# EAGLE design easiri (EAGLE 9.6.2)
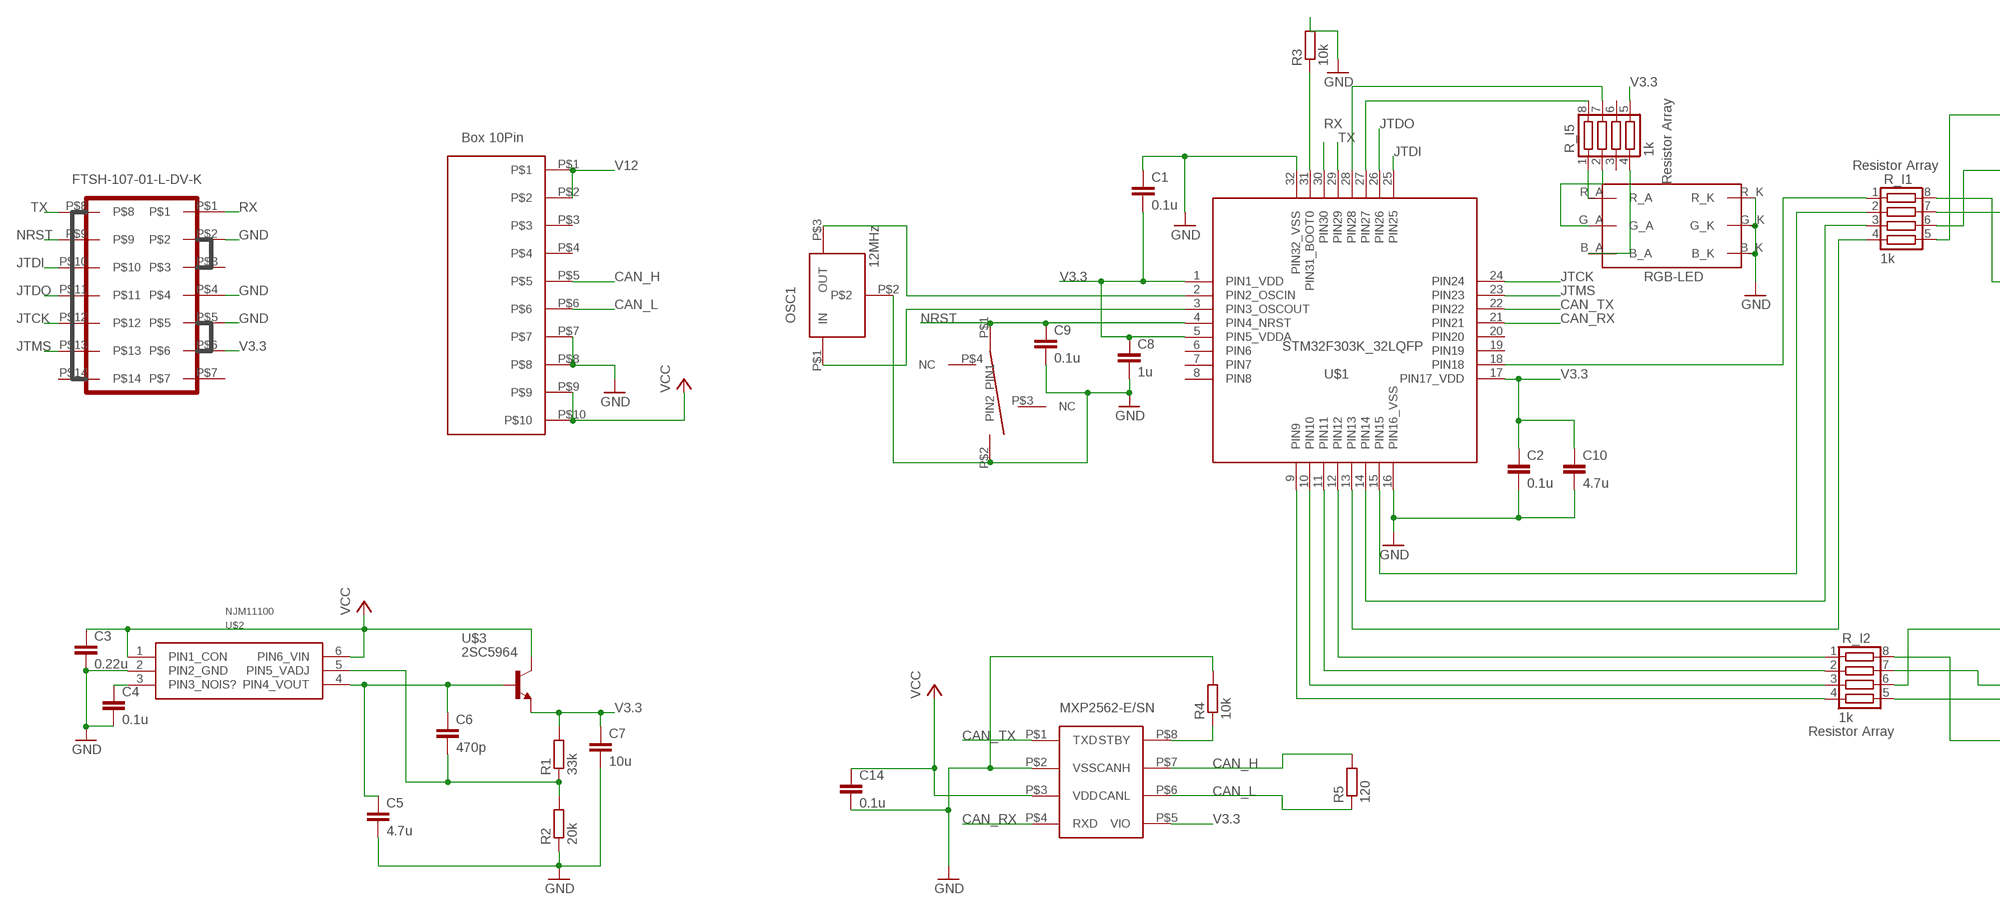
[diagram p0: schematic, sheet 1, part 1 of 2]
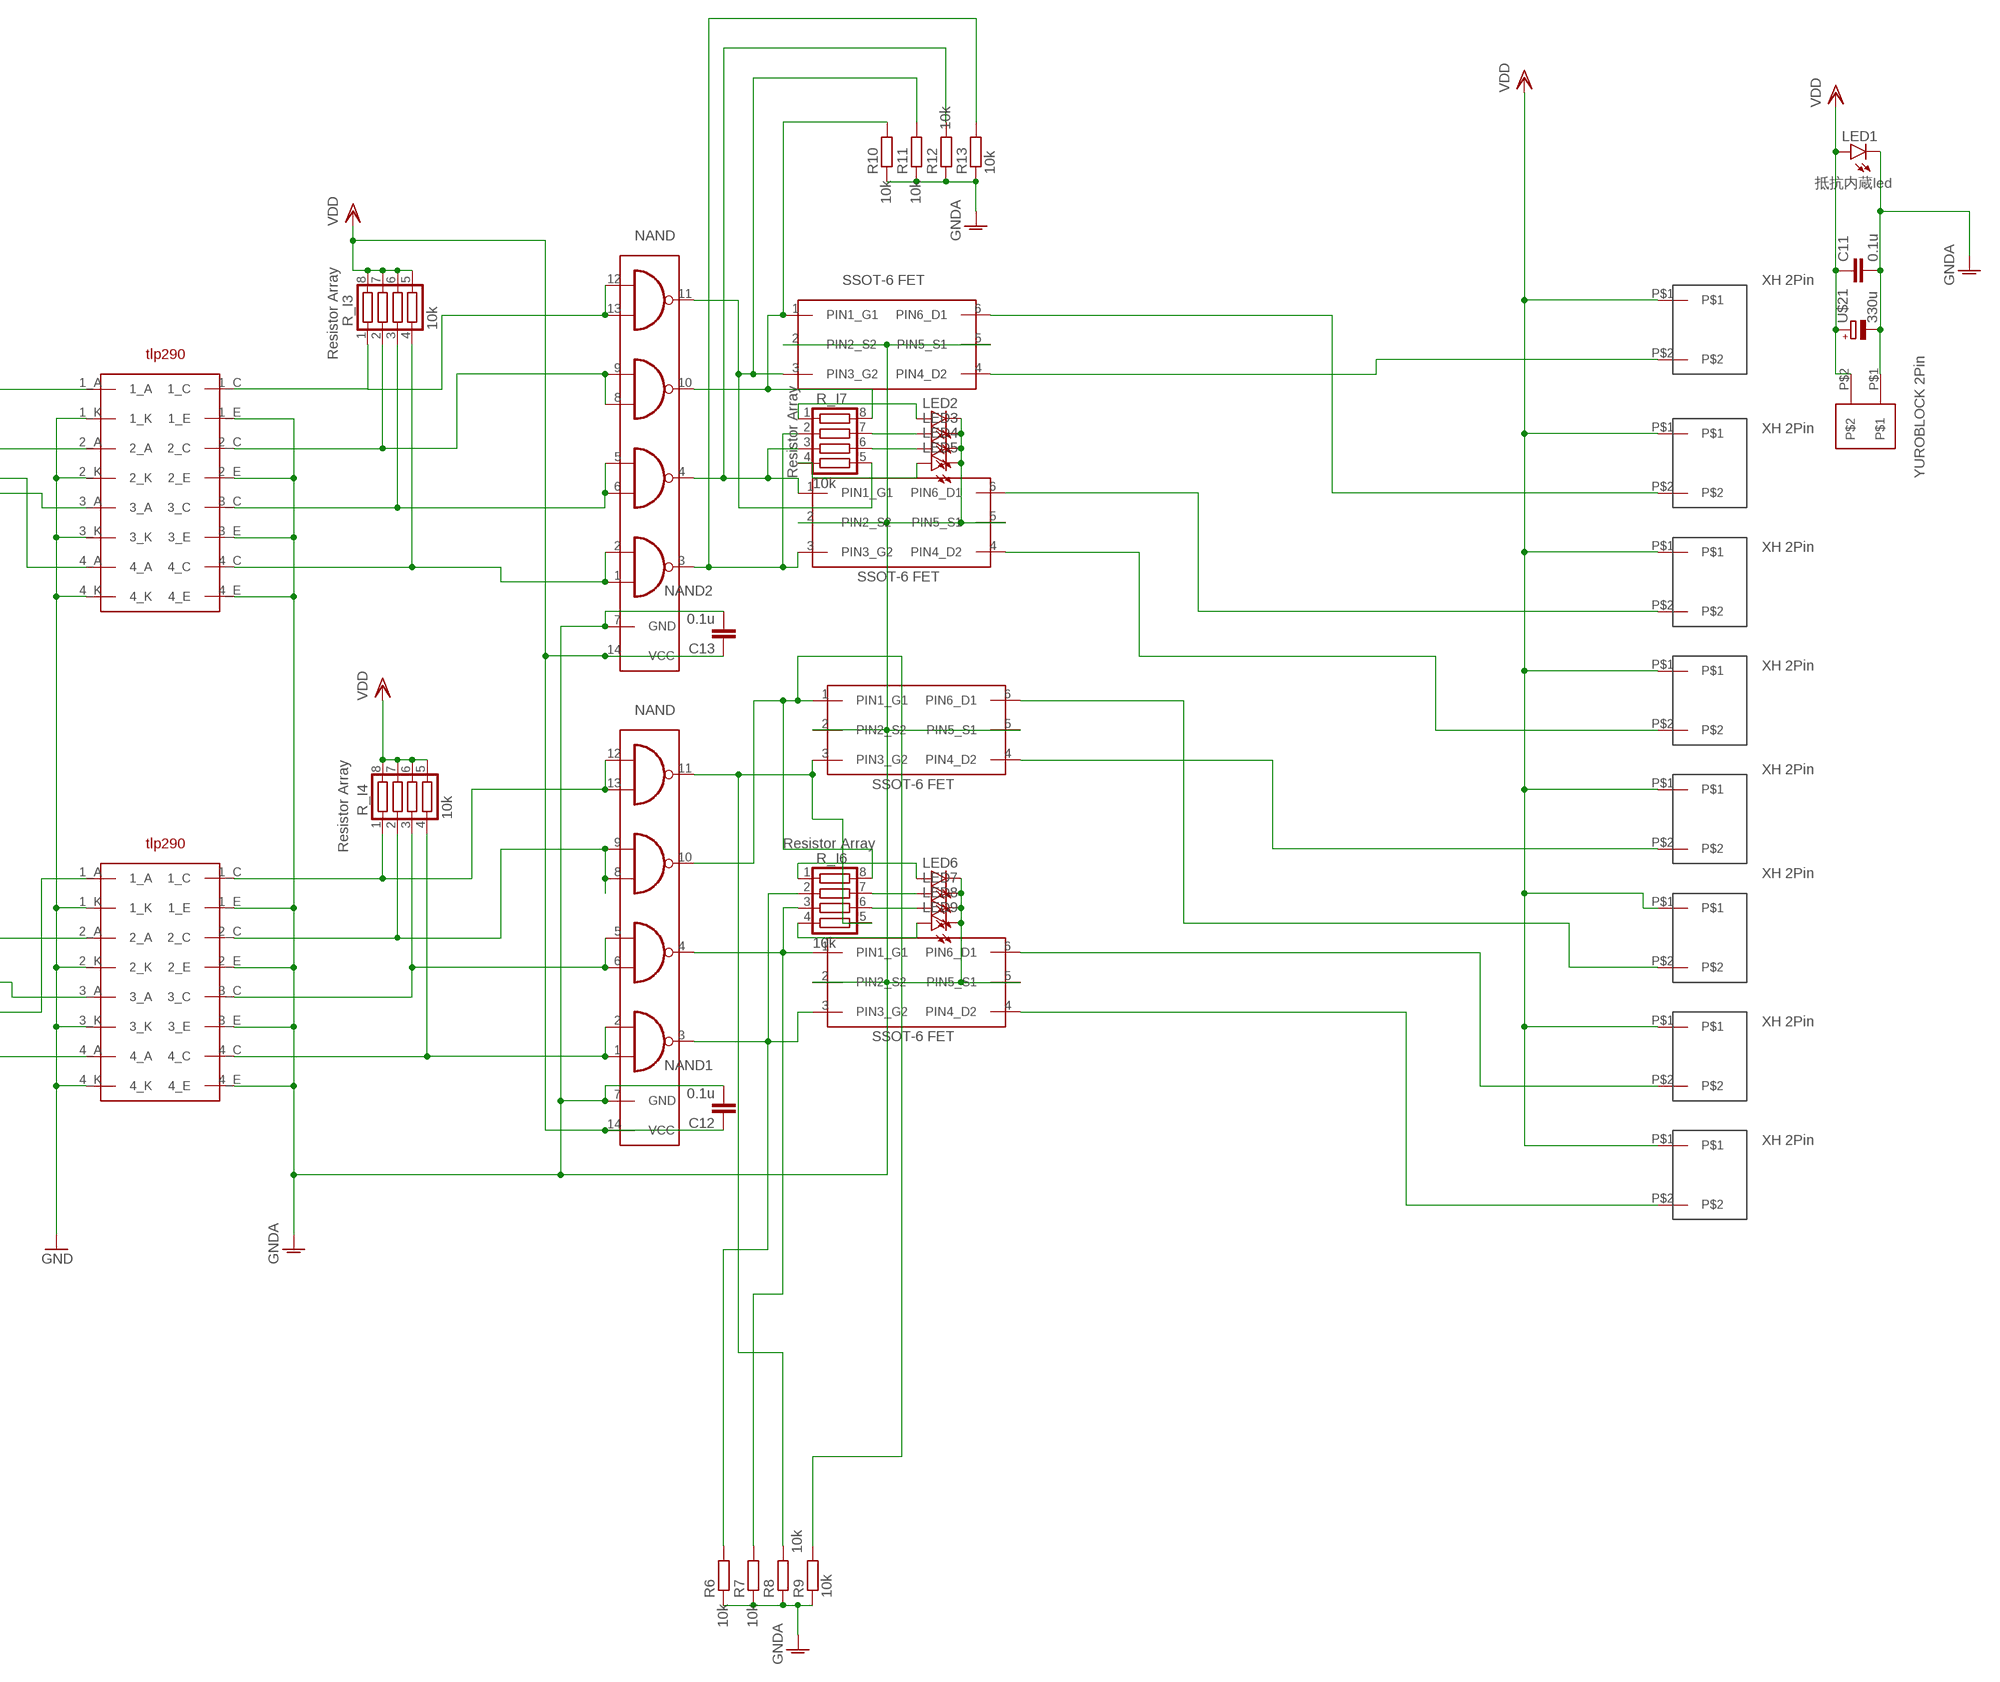
[diagram p1: schematic, sheet 1, part 2 of 2]

## Parts
BOX10P-L2  BOX10PBOX10P-L  [BOX10P-L]
C1  0.1u  C-EUC1608  [C1608]
C2  0.1u  C-EUC1608  [C1608]
C3  0.22u  C-EUC2012  [C2012]
C4  0.1u  C-EUC1608  [C1608]
C5  4.7u  C-EUC2012  [C2012]
C6  470p  C-EUC1608  [C1608]
C7  10u  C-EUC2012  [C2012]
C8  1u  C-EUC1608  [C1608]
C9  0.1u  C-EUC1608  [C1608]
C10  4.7u  C-EUC2012  [C2012]
C11  0.1u  C-EUC1608  [C1608]
C12  0.1u  C-EUC1608  [C1608]
C13  0.1u  C-EUC1608  [C1608]
C14  0.1u  C-EUC1608  [C1608]
ES1  XH_2P  [XH_2P]
ES2  XH_2P  [XH_2P]
ES3  XH_2P  [XH_2P]
ES4  XH_2P  [XH_2P]
ES5  XH_2P  [XH_2P]
ES6  XH_2P  [XH_2P]
ES7  XH_2P  [XH_2P]
ES8  XH_2P  [XH_2P]
LED1  抵抗内蔵led  LED5MM  [LED5MM]
LED2  1608LED  [1608]
LED3  1608LED  [1608]
LED4  1608LED  [1608]
LED5  1608LED  [1608]
LED6  1608LED  [1608]
LED7  1608LED  [1608]
LED8  1608LED  [1608]
LED9  1608LED  [1608]
NAND1  14PIN_NAND2  [TSSOP14]
NAND2  14PIN_NAND2  [TSSOP14]
OSC1  12MHz  CSTN#  [CSTNE#]
R1  33k  R_REG  [1608]
R2  20k  R_REG  [1608]
R3  10k  R_REG  [1608]
R4  10k  R_REG  [1608]
R5  120  R_REG  [1608]
R6  10k  R_REG  [1608]
R7  10k  R_REG  [1608]
R8  10k  R_REG  [1608]
R9  10k  R_REG  [1608]
R10  10k  R_REG  [1608]
R11  10k  R_REG  [1608]
R12  10k  R_REG  [1608]
R13  10k  R_REG  [1608]
R_I1  1k  R_SHUGOU  [0603X4RESISTOR]
R_I2  1k  R_SHUGOU  [0603X4RESISTOR]
R_I3  10k  R_SHUGOU2  [1005X4RESISTOR]
R_I4  10k  R_SHUGOU2  [1005X4RESISTOR]
R_I5  1k  R_SHUGOU  [0603X4RESISTOR]
R_I6  10k  R_SHUGOU2  [1005X4RESISTOR]
R_I7  10k  R_SHUGOU2  [1005X4RESISTOR]
U$1  STM32F303K_32LQFP  [LQFP32-7X7]
U$2  NJM11100  [SOT23-6]
U$3  2SC5964  [PCP]
U$4  TAKUTOSUITTI2  [TAKUTOSUITTI2]
U$5  MCP2562MCP2561-SN  [SOIC8]
U$6  TLP290-4  [TLP290]
U$7  TLP290-4  [TLP290]
U$8  SSOT6_FET  [SSOT6]
U$9  SSOT6_FET  [SSOT6]
U$10  SSOT6_FET  [SSOT6]
U$11  SSOT6_FET  [SSOT6]
U$12  YUROBLOCK2  [YUROBLOCK2]
U$13  FTSH-107-01-L-DV-K  [FTSH-107-01-L-DV-K]
U$21  330u  C_DEKAI  [1014CAPA]
U$23  RGB_LED  [RGB_LED]

## Nets
CAN_H: BOX10P-L2.P$5 R5.2 U$5.P$7(CANH)
CAN_L: BOX10P-L2.P$6 R5.1 U$5.P$6(CANL)
CAN_RX: U$1.21(PIN21) U$5.P$4(RXD)
CAN_TX: U$1.22(PIN22) U$5.P$1(TXD)
GND: BOX10P-L2.P$7 BOX10P-L2.P$8 C1.1 C2.2 C3.2 C4.2 C5.2 C7.2 C8.2 C9.2 C10.2 C14.2 OSC1.P$2 R2.1 R3.2 R4.2 U$1.16(PIN16_VSS) U$1.32(PIN32_VSS) U$2.2(PIN2_GND) U$4.P$2(PIN2) U$5.P$2(VSS) U$6.1_K U$6.2_K U$6.3_K U$6.4_K U$7.1_K U$7.2_K U$7.3_K U$7.4_K U$13.P$2 U$13.P$4 U$13.P$5 U$23.B_K U$23.G_K U$23.R_K
GNDA: C11.2 C12.2 C13.2 LED1.K(C) LED2.K LED3.K LED4.K LED5.K LED6.K LED7.K LED8.K LED9.K NAND1.7(GND) NAND2.7(GND) R6.1 R7.1 R8.1 R9.1 R10.1 R11.1 R12.1 R13.1 U$6.1_E U$6.2_E U$6.3_E U$6.4_E U$7.1_E U$7.2_E U$7.3_E U$7.4_E U$8.2(PIN2_S2) U$8.5(PIN5_S1) U$9.2(PIN2_S2) U$9.5(PIN5_S1) U$10.2(PIN2_S2) U$10.5(PIN5_S1) U$11.2(PIN2_S2) U$11.5(PIN5_S1) U$12.P$1 U$21.-
JTCK: U$1.24(PIN24) U$13.P$12
JTDI: U$1.25(PIN25) U$13.P$10
JTDO: U$1.26(PIN26) U$13.P$11
JTMS: U$1.23(PIN23) U$13.P$13
N$1: C6.2 R1.1 R2.2 U$2.5(PIN5_VADJ)
N$2: C4.1 U$2.3(PIN3_NOIS?)
N$3: C5.1 C6.1 U$2.4(PIN4_VOUT) U$3.1(B)
N$4: OSC1.P$1(IN) U$1.3(PIN3_OSCOUT)
N$5: OSC1.P$3(OUT) U$1.2(PIN2_OSCIN)
N$6: R3.1 U$1.31(PIN31_BOOT0)
N$7: R_I1.8 U$6.4_A
N$8: R_I1.7 U$6.3_A
N$9: R4.1 U$5.P$8(STBY)
N$10: R_I1.6 U$6.2_A
N$11: R_I5.8 U$1.27(PIN27)
N$12: R_I2.6 U$7.2_A
N$13: NAND2.12(4B) NAND2.13(4A) R_I3.1 U$6.1_C
N$14: R_I2.7 U$7.3_A
N$15: R_I2.8 U$7.4_A
N$16: R_I2.5 U$7.1_A
N$17: NAND1.5(2B) NAND1.6(2A) R_I4.3 U$7.3_C
N$18: NAND2.5(2B) NAND2.6(2A) R_I3.3 U$6.3_C
N$19: NAND1.1(1A) NAND1.2(1B) R_I4.4 U$7.4_C
N$20: NAND1.3(1Y) R6.2 R_I6.2 U$11.3(PIN3_G2)
N$21: NAND1.8(3A) NAND1.9(3B) R_I4.2 U$7.2_C
N$22: LED8.A R_I6.6
N$23: LED7.A R_I6.7
N$24: ES3.P$2 U$9.6(PIN6_D1)
N$25: ES1.P$2 U$8.4(PIN4_D2)
N$26: ES2.P$2 U$8.6(PIN6_D1)
N$27: ES4.P$2 U$9.4(PIN4_D2)
N$28: LED4.A R_I7.6
N$29: ES6.P$2 U$10.6(PIN6_D1)
N$30: ES7.P$2 U$11.6(PIN6_D1)
N$31: R_I2.1 U$1.12(PIN12)
N$32: ES8.P$2 U$11.4(PIN4_D2)
N$33: R_I2.2 U$1.11(PIN11)
N$34: R_I2.3 U$1.10(PIN10)
N$35: R_I2.4 U$1.9(PIN9)
N$36: R_I1.4 U$1.13(PIN13)
N$37: R_I1.3 U$1.14(PIN14)
N$38: R_I1.5 U$6.1_A
N$39: R_I1.2 U$1.15(PIN15)
N$40: R_I5.7 U$1.28(PIN28)
N$41: R_I1.1 U$1.18(PIN18)
N$42: R_I5.4 U$23.B_A
N$43: R_I5.1 U$23.R_A
N$44: R_I5.2 U$23.G_A
N$45: NAND1.4(2Y) R7.2 R_I6.3 U$11.1(PIN1_G1)
N$46: ES5.P$2 U$10.4(PIN4_D2)
N$47: NAND2.8(3A) NAND2.9(3B) R_I3.2 U$6.2_C
N$48: NAND2.1(1A) NAND2.2(1B) R_I3.4 U$6.4_C
N$49: NAND1.12(4B) NAND1.13(4A) R_I4.1 U$7.1_C
N$50: NAND1.10(3Y) R9.2 R_I6.8 U$10.1(PIN1_G1)
N$51: NAND2.3(1Y) R13.2 R_I7.2 U$9.3(PIN3_G2)
N$52: NAND2.4(2Y) R12.2 R_I7.3 U$9.1(PIN1_G1)
N$53: NAND2.10(3Y) R10.2 R_I7.8 U$8.1(PIN1_G1)
N$54: NAND2.11(4Y) R11.2 R_I7.5 U$8.3(PIN3_G2)
N$55: LED9.A R_I6.4
N$56: LED6.A R_I6.1
N$57: NAND1.11(4Y) R8.2 R_I6.5 U$10.3(PIN3_G2)
N$58: LED3.A R_I7.7
N$59: LED5.A R_I7.4
N$60: LED2.A R_I7.1
NRST: C9.1 U$1.4(PIN4_NRST) U$4.P$1(PIN1) U$13.P$9
RX: U$1.30(PIN30) U$13.P$1
TX: U$1.29(PIN29) U$13.P$8
V3.3: C1.2 C2.1 C7.1 C8.1 C10.1 R1.2 R_I5.5 U$1.1(PIN1_VDD) U$1.5(PIN5_VDDA) U$1.17(PIN17_VDD) U$3.3(E) U$5.P$5(VIO) U$13.P$6
V12: BOX10P-L2.P$1 BOX10P-L2.P$2
VCC: BOX10P-L2.P$9 BOX10P-L2.P$10 C3.1 C14.1 U$2.1(PIN1_CON) U$2.6(PIN6_VIN) U$3.2(C) U$3.2@2(C) U$5.P$3(VDD)
VDD: C11.1 C12.1 C13.1 ES1.P$1 ES2.P$1 ES3.P$1 ES4.P$1 ES5.P$1 ES6.P$1 ES7.P$1 ES8.P$1 LED1.A NAND1.14(VCC) NAND2.14(VCC) R_I3.5 R_I3.6 R_I3.7 R_I3.8 R_I4.5 R_I4.6 R_I4.7 R_I4.8 U$12.P$2 U$21.+
Unconnected: BOX10P-L2.P$3 BOX10P-L2.P$4 R_I5.3 R_I5.6 U$1.6(PIN6) U$1.7(PIN7) U$1.8(PIN8) U$1.19(PIN19) U$1.20(PIN20) U$4.P$3(NC) U$4.P$4(NC) U$13.P$3 U$13.P$7 U$13.P$14

## Notes on the sheet
- NAND
- SSOT-6 FET | XH 2Pin
- Resistor Array
- Box 10Pin
- XH 2Pin
- Resistor Array
- FTSH-107-01-L-DV-K | Resistor Array
- Resistor Array | YUROBLOCK 2Pin
- XH 2Pin
- RGB-LED
- SSOT-6 FET
- XH 2Pin
- NAND
- Resistor Array
- XH 2Pin
- SSOT-6 FET
- Resistor Array
- XH 2Pin
- MXP2562-E/SN | XH 2Pin
- Resistor Array | SSOT-6 FET
- XH 2Pin

## Library data of the parts
BOX10P-L2 = user_conector:BOX10P
C1-C14 = rcl:C-EU: CAPACITOR, European symbol; SPICEPREFIX: C
ES1-ES8 = user_conector:XH_2P: トップ型xhコネクタ2ピン 秋月に売ってるやつ
LED1 = led:LED: LED OSRAM: - CHIPLED LG R971, LG N971, LY N971, LG Q971, LY Q971, LO R971, LY R971 LH N974, LH R974 LS Q976, LO Q976, LY Q976 LO Q996 - Hyper CHIPLED LW Q18S LB Q993, LB Q99A, LB R99A - SideLED LS A670, LO A670, LY A670, LG A670, LP A670 LB A673, LV A673, LT A673, LW A673 LH A674 LY A675 LS A676, LA A676, LO A676, LY A676, LW A676 LS A679, LY A679, LG A679 - Hyper Micro SIDELED® LS Y876, LA Y876, LO Y876, LY Y876 LT Y87S - SmartLED LW L88C, LW L88S LB L89C, LB L89S, LG L890 LS L89K, LO L89K, LY L89K LS L896, LA L896, LO L896, LY L896 - TOPLED LS T670, LO T670, LY T670, LG T670, LP T670 LSG T670, LSP T670, LSY T670, LOP T670, LYG T670 LG T671, LOG T671, LSG T671 LB T673, LV T673, LT T673, LW T673 LH T674 LS T676, LA T676, LO T676, LY T676, LB T676, LH T676, LSB T676, LW T676 LB T67C, LV T67C, LT T67C, LS T67K, LO T67K, LY T67K, LW E67C LS E67B, LA E67B, LO E67B, LY E67B, LB E67C, LV E67C, LT E67C LW T67C LS T679, LY T679, LG T679 LS T770, LO T770, LY T770, LG T770, LP T770 LB T773, LV T773, LT T773, LW T773 LH T774 LS E675, LA E675, LY E675, LS T675 LS T776, LA T776, LO T776, LY T776, LB T776 LHGB T686 LT T68C, LB T68C - Hyper Mini TOPLED® LB M676 - Mini TOPLED Santana® LG M470 LS M47K, LO M47K, LY M47K Source: http://www.osram.convergy.de LUXEON: - LUMILED® LXK2-PW12-R00, LXK2-PW12-S00, LXK2-PW14-U00, LXK2-PW14-V00 LXK2-PM12-R00, LXK2-PM12-S00, LXK2-PM14-U00 LXK2-PE12-Q00, LXK2-PE12-R00, LXK2-PE12-S00, LXK2-PE14-T00, LXK2-PE14-U00 LXK2-PB12-K00, LXK2-PB12-L00, LXK2-PB12-M00, LXK2-PB14-N00, LXK2-PB14-P00, LXK2-PB14-Q00 LXK2-PR12-L00, LXK2-PR12-M00, LXK2-PR14-Q00, LXK2-PR14-R00 LXK2-PD12-Q00, LXK2-PD12-R00, LXK2-PD12-S00 LXK2-PH12-R00, LXK2-PH12-S00 LXK2-PL12-P00, LXK2-PL12-Q00, LXK2-PL12-R00 Source: www.luxeon.com KINGBRIGHT: KA-3528ASYC Source: www.kingbright.com
LED2-LED9 = user_leds:1608LED: 1608LED
NAND1 NAND2 = user_ic:14PIN_NAND
OSC1 = user_osc:CSTN#: ムラタのセラロック （セラミック振動子） 周波数はいくつか種類あり(valueで設定して) 秋月電子通商のトップ/パーツ一般/発振子/セラミック発振子 uCからのoutが入るのがinであることに注意 https://akizukidenshi.com/catalog/c/cceralock/
R1-R13 = user_rcl:R_REG: 1608パッケージのチップ抵抗 ガッコのリールの抵抗はたぶんこれ
R_I1-R_I7 = user_rcl:R_SHUGOU
U$1 = user_ic:STM32F303K_32LQFP
U$2 = user_ic:NJM11100: 可変型レギュレータ 秋月電子[I-06655]
U$3 = user_tr_fet_igbt:2SC5964: rs品番774-0746 PCP
U$4 = user_swich:TAKUTOSUITTI2
U$5 = user_ic:MCP2562
U$6 U$7 = user_ic:TLP290-4: フォトリフレクタ オープンドレイン インバータ出力
U$8-U$11 = user_tr_fet_igbt:SSOT6_FET
U$12 = user_conector:YUROBLOCK2: ユーロブロック 秋月電子[P-11599]
U$13 = user_conector:FTSH-107-01-L-DV-K
U$21 = user_rcl:C_DEKAI
U$23 = user_leds:RGB_LED: 秋月電子通商 I-12726

## Board
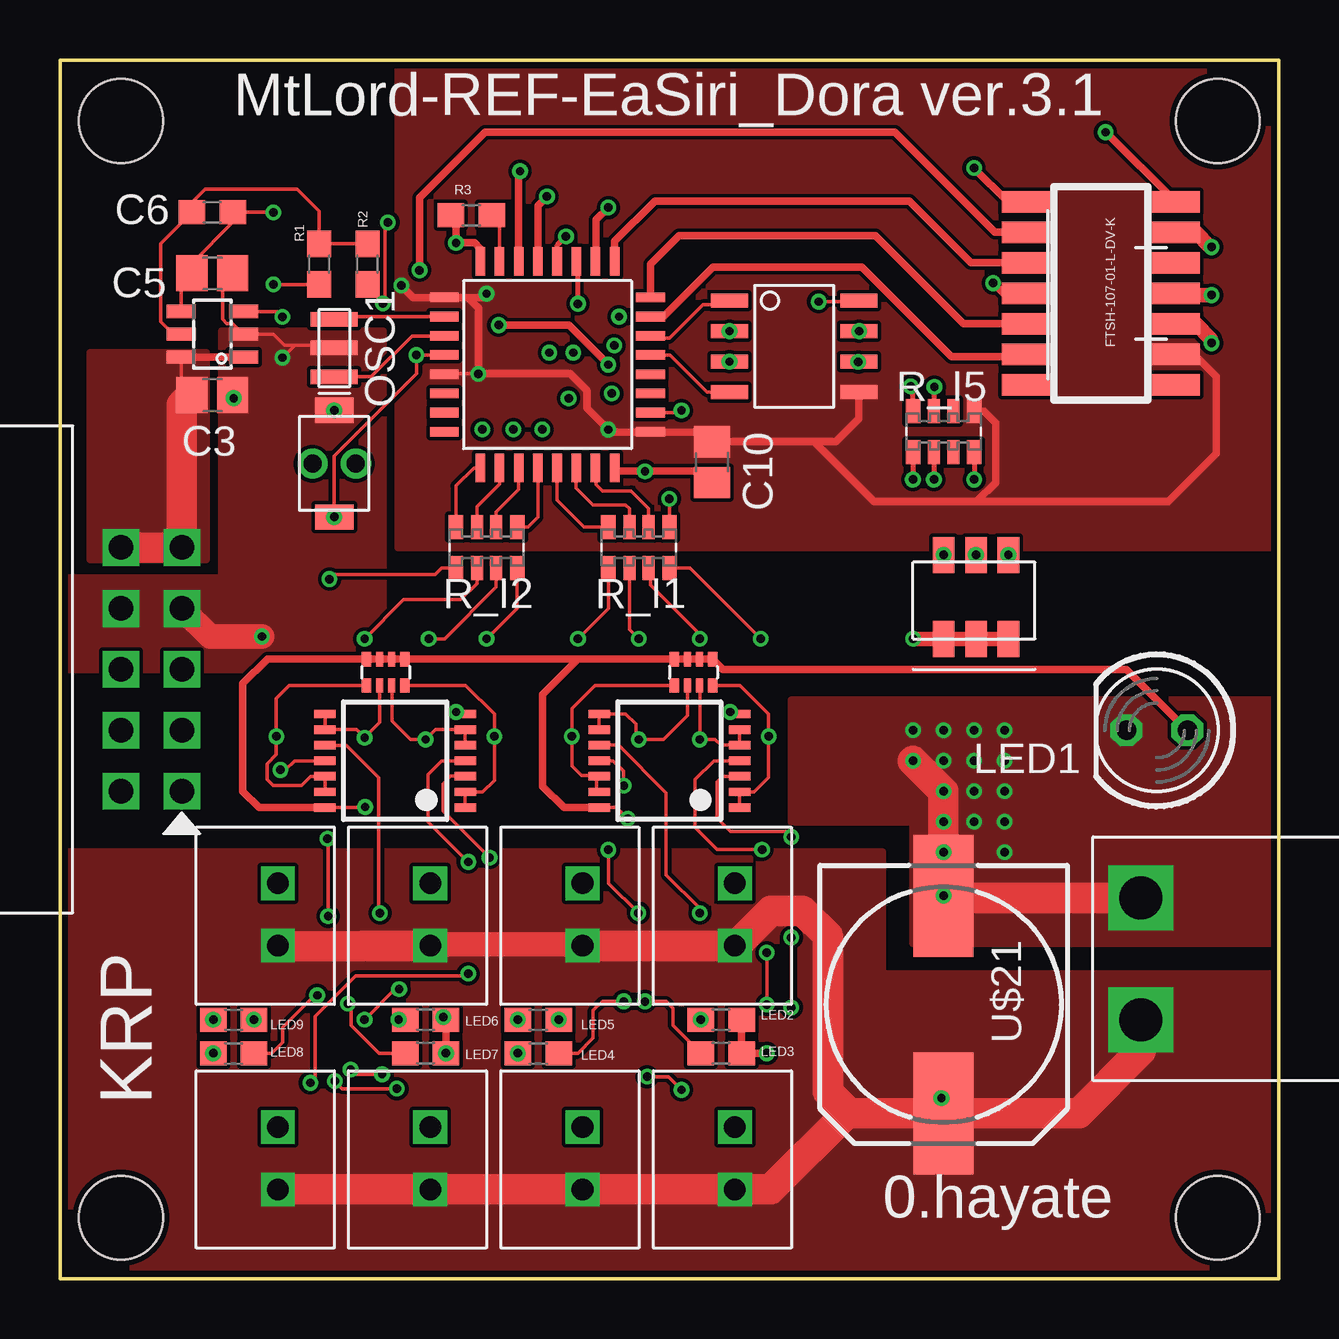
[diagram p2: board, top side]
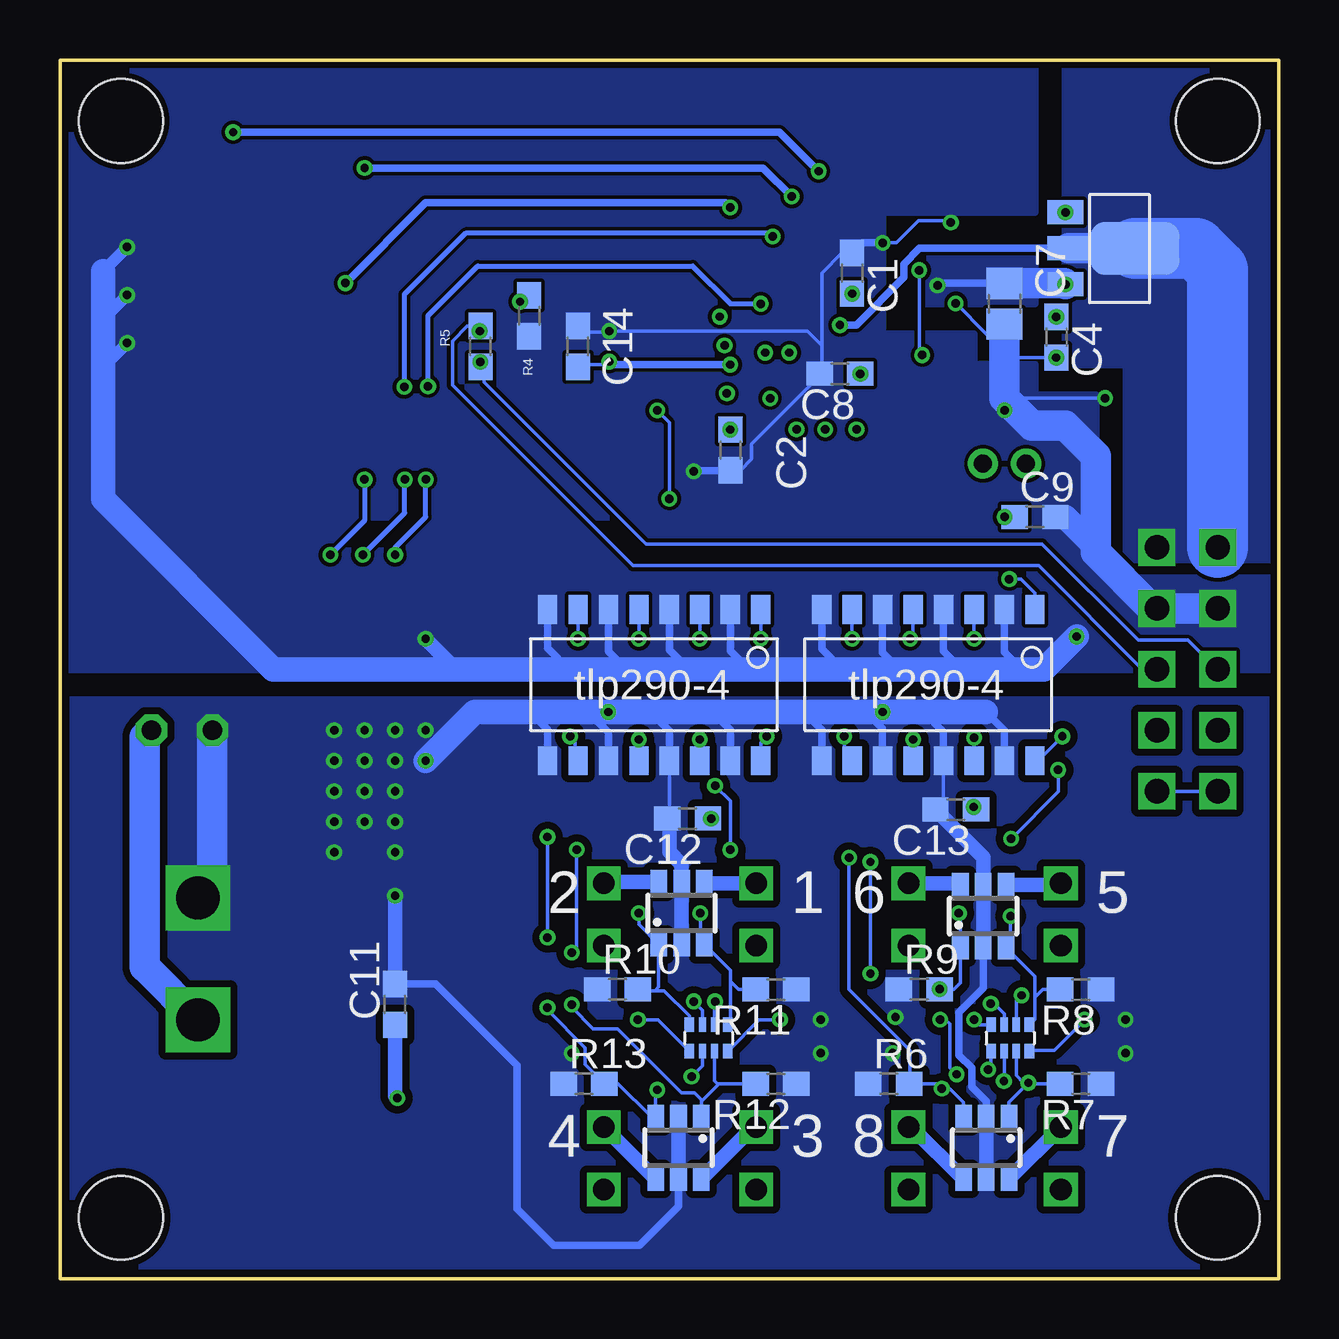
[diagram p3: board, bottom side, seen from below]

Size 50.8 x 50.8 mm. Coordinates in mm from the lower left corner, seen from the top.
Outline: 0,0 0,50.8 50.8,50.8 50.8,0 0,0
Copper layers (1*16): Top 0.035mm / dielectric 1.5mm / Bottom 0.035mm
Design rules "SeeedStudio_2layer_DRU_no_angle_20140221": minimum track width 6mil, minimum drill 12mil, track to track 6mil, track to pad 6mil, pad to pad 6mil, via to via 6mil, smd to smd 0mil, copper to edge 10mil, drill to drill 10mil, minimum pad ring 10mil, minimum via ring 6mil, stop-mask expansion 2mil, vias tented up to drill 100mil, thermal gap 10mil
Holes 3.5 mm at 2.54,2.54 48.26,2.54 48.26,48.26 2.54,48.26

### Footprints (pad centres in the part's own frame; a part is rotated, then mirrored left to right if it is on the bottom)
BOX10P-L = drill 1.02 square: P$1 5.08,2.54; P$2 5.08,0; P$3 2.54,2.54; P$4 2.54,0; P$5 0,2.54; P$6 0,0; P$7 -2.54,2.54; P$8 -2.54,0; P$9 -5.08,2.54; P$10 -5.08,0
C1608 = smd 1.1 x 1: 1 -0.85,0; 2 0.85,0
C2012 = smd 1.3 x 1.5: 1 -0.85,0; 2 0.85,0
XH_2P = drill 0.9 square: P$1 2.45,2.35; P$2 5.05,2.35
LED5MM = drill 0.813 octagon: A -1.27,0; K 1.27,0
1608 = smd 1.1 x 1: A -0.85,0; K 0.85,0
TSSOP14 = smd 0.35 x 0.9: 1 -1.95,-2.925; 2 -1.3,-2.925; 3 -0.65,-2.925; 4 0,-2.925; 5 0.65,-2.925; 6 1.3,-2.925; 7 1.95,-2.925; 8 1.95,2.925; 9 1.3,2.925; 10 0.65,2.925; 11 0,2.925; 12 -0.65,2.925; 13 -1.3,2.925; 14 -1.95,2.925
CSTNE# = smd 0.6 x 1.95: P$1 0,0; P$2 1.2,0; P$3 2.4,0
1608' = smd 1.1 x 1: 1 -0.85,0; 2 0.85,0
0603X4RESISTOR = smd 0.6 x 1: 1 -1.275,-0.85; 4 1.275,-0.85; 5 1.275,0.85; 8 -1.275,0.85 | smd 0.5 x 1: 2 -0.4,-0.85; 3 0.4,-0.85; 6 0.4,0.85; 7 -0.4,0.85
1005X4RESISTOR = smd 0.4 x 0.6: 1 0.2,-0.8; 4 1.8,-0.8; 5 1.8,0.3; 8 0.2,0.3 | smd 0.3 x 0.6: 2 0.75,-0.8; 3 1.25,-0.8; 6 1.25,0.3; 7 0.75,0.3
LQFP32-7X7 = smd 1.2 x 0.4: 1 -4.3,2.8; 2 -4.3,2; 3 -4.3,1.2; 4 -4.3,0.4; 5 -4.3,-0.4; 6 -4.3,-1.2; 7 -4.3,-2; 8 -4.3,-2.8; 17 4.3,-2.8; 18 4.3,-2; 19 4.3,-1.2; 20 4.3,-0.4; 21 4.3,0.4; 22 4.3,1.2; 23 4.3,2; 24 4.3,2.8 | smd 0.4 x 1.2: 9 -2.8,-4.3; 10 -2,-4.3; 11 -1.2,-4.3; 12 -0.4,-4.3; 13 0.4,-4.3; 14 1.2,-4.3; 15 2,-4.3; 16 2.8,-4.3; 25 2.8,4.3; 26 2,4.3; 27 1.2,4.3; 28 0.4,4.3; 29 -0.4,4.3; 30 -1.2,4.3; 31 -2,4.3; 32 -2.8,4.3
SOT23-6 = smd 0.55 x 1.2: 1 -0.95,-1.3; 2 0,-1.3; 3 0.95,-1.3; 4 0.95,1.3; 5 0,1.3; 6 -0.95,1.3
PCP = smd 1 x 1.5: 1 0,0; 3 3,0 | smd 1 x 1.8: 2 1.5,0.15 | smd 2.2 x 3.7: 2@2 1.5,2.9
TAKUTOSUITTI2 = smd 1.05 x 1.6: P$1 0,0; P$2 4.45,0 | drill 0.75: P$3 2.225,-0.9; P$4 2.225,0.9
SOIC8 = smd 1.55 x 0.6: P$1 -2.7,1.905; P$2 -2.7,0.635; P$3 -2.7,-0.635; P$4 -2.7,-1.905; P$5 2.7,-1.905; P$6 2.7,-0.635; P$7 2.7,0.635; P$8 2.7,1.905
TLP290 = smd 0.8 x 1.2: 1_A 0,-6.3; 1_C 0,0; 1_E 1.27,0; 1_K 1.27,-6.3; 2_A 2.54,-6.3; 2_C 2.54,0; 2_E 3.81,0; 2_K 3.81,-6.3; 3_A 5.08,-6.3; 3_C 5.08,0; 3_E 6.35,0; 3_K 6.35,-6.3; 4_A 7.62,-6.3; 4_C 7.62,0; 4_E 8.89,0; 4_K 8.89,-6.3
SSOT6 = smd 0.69 x 0.99: 1 -0.95,-1.3; 2 0,-1.3; 3 0.95,-1.3; 4 0.95,1.3; 5 0,1.3; 6 -0.95,1.3
YUROBLOCK2 = drill 1.8 square: P$1 2,7.62; P$2 2,2.54
FTSH-107-01-L-DV-K = smd 0.889 x 2.032: P$1 0.635,1.651; P$2 1.905,1.651; P$3 3.175,1.651; P$4 4.445,1.651; P$5 5.715,1.651; P$6 6.985,1.651; P$7 8.255,1.651; P$8 0.635,-4.572; P$9 1.905,-4.572; P$10 3.175,-4.572; P$11 4.445,-4.572; P$12 5.715,-4.572; P$13 6.985,-4.572; P$14 8.255,-4.572
1014CAPA = smd 5.079 x 2.5: + 4.531,0; - -4.531,0
RGB_LED = smd 1.5 x 0.9: B_A 3.5,-2.7; B_K 0,-2.7; G_A 3.5,-1.35; G_K 0,-1.35; R_A 3.5,0; R_K 0,0

### Placement (x,y rotation side)
BOX10P-L2  2.54,25.4 270 top
C1  17.78,41.91 270 bottom
C2  22.86,34.54 270 bottom
C3  6.35,36.83 0 top
C4  9.27,39.24 270 bottom
C5  6.35,41.91 0 top
C6  6.35,44.45 180 top
C7  11.43,40.64 270 bottom
C8  18.29,37.72 180 bottom
C9  10.16,31.75 0 bottom
C10  27.18,34.04 270 top
C11  36.83,11.43 90 bottom
C12  24.64,19.18 180 bottom
C13  13.46,19.56 180 bottom
C14  29.21,38.86 90 bottom
ES1  24.13,11.43 90 top
ES2  30.48,11.43 90 top
ES3  24.13,1.27 90 top
ES4  30.48,1.27 90 top
ES5  11.43,11.43 90 top
ES6  17.78,11.43 90 top
ES7  11.43,1.27 90 top
ES8  17.78,1.27 90 top
LED1  45.72,22.86 180 top
LED2  27.56,10.79 0 top
LED3  27.56,9.4 0 top
LED4  19.94,9.4 180 top
LED5  19.94,10.79 180 top
LED6  15.24,10.79 0 top
LED7  15.24,9.4 0 top
LED8  7.24,9.4 180 top
LED9  7.24,10.79 180 top
NAND1  13.97,21.59 90 top
NAND2  25.4,21.59 90 top
OSC1  11.43,37.59 90 top
R1  33k  [1608']  10.79,42.29 270 top
R2  20k  [1608']  12.83,42.29 90 top
R3  10k  [1608']  17.14,44.32 180 top
R4  10k  [1608']  31.24,40.13 270 bottom
R5  120  [1608']  33.27,38.86 90 bottom
R6  10k  [1608']  16.26,8.13 0 bottom
R7  10k  [1608']  8.26,8.13 180 bottom
R8  10k  [1608']  8.26,12.06 180 bottom
R9  10k  [1608']  14.99,12.06 0 bottom
R10  10k  [1608']  27.56,12.06 0 bottom
R11  10k  [1608']  20.95,12.06 180 bottom
R12  10k  [1608']  20.95,8.13 180 bottom
R13  10k  [1608']  28.96,8.13 0 bottom
R_I1  24.13,30.48 180 top
R_I2  17.78,30.48 180 top
R_I3  25.4,25.53 0 top
R_I4  12.57,25.53 0 top
R_I5  36.83,35.31 0 top
R_I6  12.19,10.29 0 bottom
R_I7  24.77,10.29 0 bottom
U$1  20.32,38.1 0 top
U$2  6.35,39.37 90 top
U$3  8.89,44.45 270 bottom
U$4  11.43,31.75 90 top
U$5  30.61,38.86 0 top
U$6  21.59,21.59 180 bottom
U$7  10.16,21.59 180 bottom
U$8  24.89,15.24 0 bottom
U$9  25.02,5.46 180 bottom
U$10  12.32,15.11 0 bottom
U$11  12.19,5.46 180 bottom
U$12  43.05,8.26 0 top
U$13  44.85,45.52 270 top
U$21  36.83,11.43 270 top
U$23  36.83,26.67 90 top

### Tracks (layer width: path | path; a pad name or v marks a point on that pad's centre or on a via)
CAN_H  (via drill 0.35)
  Bottom 0.152: BOX10P-L2.P$5 5.68,25.4 10,29.72 26.92,29.72 34.44,37.24 34.44,39.09 33.82,39.71 R5.2 33.27,39.53 U$5.P$7
  other vias: 33.31,39.5
CAN_L  (via drill 0.35)
  Top 0.152: v33.27,38.21 33.29,38.21 U$5.P$6
  Bottom 0.152: BOX10P-L2.P$6 2.58,25.4 3.79,26.62 5.86,26.62 9.87,30.63 26.37,30.63 33.12,37.38 33.12,37.86 R5.1 v33.27,38.21
CAN_RX
  Top 0.152: U$5.P$4 26.98,36.96 25.43,38.5 U$1.21
CAN_TX
  Top 0.152: U$5.P$1 27.74,40.6 26.8,40.6 25.4,39.2 24.72,39.2 U$1.22
GND  (via drill 0.35)
  Top 0.152: C3.2 7.24,36.79 v7.24,36.7 | OSC1.P$2 11.3,38.92 9.8,38.92 | 9.8,38.92 9.34,38.92 8.89,39.37 U$2.2 7.2,39.82 6.96,39.82 6.78,39.99 6.78,41.49 C5.2 | C4.2 9.8,38.92 | v13.67,44.03 13.56,43.92 13.56,40.75 v13.46,40.66 12.83,41.29 R2.1
  Top 0.305: U$1.32 17.52,42.93 17.27,43.18 v16.51,43.18 16.51,44.11 R3.2 | U$1.16 23.27,33.66 v24.38,33.66 26.71,33.66 C10.2
  Top 0.61: v35.56,26.67 U$23.R_K U$23.G_K U$23.B_K | v48,43 47.95,43 47.34,43.62 U$13.P$2 | v48,41 46.58,41 U$13.P$4 | v48,39 47.97,39.03 47.97,39.17 47.34,39.8 U$13.P$5
  Top 1.016: v8.42,26.77 6.25,26.77 BOX10P-L2.P$7
  Bottom 0.152: C4.2 11.14,38.39 11.43,38.1 | v7.24,36.7 11.43,36.7 U$4.P$2 | 19.05,38.9 19.05,37.81 C8.2 19.14,37.63 21.97,34.8 21.97,34.16 22.44,33.69 C2.2 | 19.05,38.9 19.05,41.91 18.2,42.76 C1.1 | v13.46,40.66 12.18,39.37 11.43,39.37 | v16.51,43.18 15.93,43.18 15.02,44.09 13.73,44.09 v13.67,44.03 | C14.2 28.95,39.45 27.86,39.45 U$5.P$2 19.65,39.5 19.05,38.9
  Bottom 0.305: C2.2 24.34,33.69 v24.38,33.66 | v16.51,43.18 17.36,43.18 C1.1 | U$6.1_K 22.86,26.16 22.1,25.4 | U$6.2_K 25.4,26.2 24.6,25.4 | U$6.3_K 27.94,26.14 27.2,25.4 | U$6.4_K 30.48,26.28 29.6,25.4 | U$7.1_K 11.43,26.13 10.7,25.4 | U$7.2_K 13.97,26.17 13.2,25.4 | U$7.3_K 16.51,26.11 15.8,25.4 | U$7.4_K 19.05,26.25 18.2,25.4
  Bottom 0.508: 49,42 v48,43 | v48,41 49,40 | v48,39 49,38
  Bottom 0.61: 34.29,25.4 v35.56,26.67
  Bottom 1.016: v8.42,26.77 9.79,25.4 10.7,25.4 13.2,25.4 15.8,25.4 18.2,25.4 22.1,25.4 24.6,25.4 27.2,25.4 29.6,25.4 34.29,25.4 41.91,25.4 49,32.49 49,38 49,40 49,42 | C9.2 8.89,31.75 7.62,30.48 7.62,30.28
  Bottom 1.27: BOX10P-L2.P$8 BOX10P-L2.P$7 5.28,27.94 7.62,30.28 7.62,34.29 8.89,35.56 10.29,35.56 11.43,36.7 11.43,38.1 11.43,39.37 C7.2
  other vias: 9.27,38.39 11.43,36.2 27.91,39.5
  pour Bottom (no thermals): 45.72,41.91 51.8,41.91 51.8,25.4 -0.73,25.4 -0.73,29.21 7.62,29.21 7.62,36.83 10.16,36.83 10.16,38.1 12.7,38.1 12.7,31.75 45.72,31.75
  pour Bottom (no thermals): 51.53,41.91 51.53,51.53 10.16,51.53 10.16,44.45 16.51,44.45 16.51,39.37 12.7,39.37 12.7,31.75 45.72,31.75 45.72,41.91
  pour Top (no thermals): -0.73,29.21 6.73,29.21 6.73,39.5 13.46,39.5 13.46,25.4 -0.73,25.4
GNDA  (via drill 0.35)
  Top 0.152: NAND2.7 28.02,23.54 v27.94,23.62 | NAND1.7 16.81,23.62 v16.51,23.62 | LED6.K v15.98,10.91
  Top 0.305: LED6.K LED7.K | LED2.K LED3.K v29.46,9.4
  Top 1.27: v35.56,21.59 v36.83,20.32 v36.83,19.05 v36.83,17.78 U$21.- 36.92,15.88 U$12.P$1
  Bottom 0.152: C13.2 13.97,19.9 U$7.2_E | C12.2 25.4,19.27 U$6.2_E
  Bottom 0.305: U$9.5 25.02,3.02 26.64,1.4 30.23,1.4 31.75,2.92 31.75,8.89 35.14,12.28 C11.2 | U$7.1_E 11.43,22.85 12.2,23.62 | U$7.2_E 13.97,22.79 14.8,23.62 | U$7.3_E 16.51,22.93 17.2,23.62 | U$7.4_E 19.05,22.87 19.8,23.62 | U$6.1_E 22.86,22.88 23.6,23.62 | U$6.2_E 25.4,22.82 26.2,23.62 | U$6.3_E 27.94,22.76 28.8,23.62 | U$6.4_E 30.48,22.9 31.2,23.62 | U$10.2 12.32,12.12 13.33,11.11 13.33,9.31 12.8,8.78 12.8,8 12.19,7.39 U$11.2
  Bottom 0.406: U$12.P$1 44.45,16.48
  Bottom 0.61: C11.2 U$21.- | U$10.2 U$10.5 12.32,17.57 C13.2 | U$8.2 U$8.5 24.89,17.27 25.4,17.78 25.4,19.27 | U$9.5 U$9.2 | U$11.5 U$11.2
  Bottom 1.016: 12.2,23.62 14.8,23.62 v16.51,23.62 17.2,23.62 19.8,23.62 23.6,23.62 26.2,23.62 v27.94,23.62 28.8,23.62 31.2,23.62 33.53,23.62 v35.56,21.59
  Bottom 1.27: 44.45,16.48 LED1.K
  other vias: 36.83,15.96 35.56,22.86 36.83,22.86 36.83,21.59 38.1,22.86 38.1,21.59 38.1,20.32 38.1,19.05 39.37,17.78 39.37,19.05 39.37,20.32 39.37,21.59 39.37,22.86 6.39,10.79 6.39,9.4 19.09,10.79 19.09,9.4 16.09,9.4
  pour Bottom (isolate 0.305, no thermals): 51.53,24.13 -0.73,24.13 -0.73,-0.73 51.53,-0.73
  pour Top (no thermals): 51.53,13.97 35.56,13.97 35.56,19.05 30.48,19.05 30.48,24.13 51.53,24.13
JTCK
  Top 0.305: U$1.24 24.62,42.3 25.8,43.48 33.99,43.48 37.66,39.8 U$13.P$12
JTDI
  Top 0.305: U$1.25 23.12,43.24 24.8,44.92 35.4,44.92 37.98,42.34 U$13.P$10
JTDO  (via drill 0.35)
  Top 0.305: v22.86,44.65 22.35,44.14 22.35,42.43 U$1.26 | U$13.P$11 39.33,41.08 v38.9,41.5
  Bottom 0.305: v38.9,41.5 35.56,44.84 23.05,44.84 v22.86,44.65
JTMS
  Top 0.305: U$1.23 25.15,40.1 27.21,42.16 33.44,42.16 37.16,38.44 40.18,38.44 U$13.P$13
N$1
  Top 0.152: R2.2 R1.1 10.79,44.51 9.88,45.42 6.05,45.42 5.5,44.87 C6.2 4.2,43.15 4.2,39.9 4.73,39.37 U$2.5
N$2  (via drill 0.35)
  Top 0.152: U$2.3 9.04,40.32 C4.1
  other vias: 9.27,40.09
N$3  (via drill 0.35)
  Top 0.152: U$3.1 C6.1 7.2,44.03 5.5,42.33 C5.1 5.05,41.46 U$2.4
  other vias: 8.89,44.45
N$4
  Top 0.152: OSC1.P$1 12.97,37.59 14.68,39.3 U$1.3
N$5
  Top 0.152: 11.54,40.1 U$1.2
  Top 0.305: OSC1.P$3 11.54,40.1
N$6
  Top 0.152: U$1.31 18.32,44 R3.1
N$7  (via drill 0.35)
  Top 0.152: v29.21,26.67 26.25,29.63 R_I1.8
  Bottom 0.152: U$6.4_A v29.21,26.67
N$8  (via drill 0.35)
  Top 0.152: R_I1.7 24.62,29.54 24.62,28.91 26.67,26.86 v26.67,26.67
  Bottom 0.152: v26.67,26.67 U$6.3_A
N$9  (via drill 0.35)
  Top 0.152: U$5.P$8 33.27,40.73 v31.62,40.73
  Bottom 0.152: R4.1 31.37,40.98 v31.62,40.73
N$10  (via drill 0.35)
  Top 0.152: v24.13,26.67 23.73,27.07 R_I1.6
  Bottom 0.152: U$6.2_A v24.13,26.67
N$11  (via drill 0.35)
  Top 0.2: R_I5.8 35.55,37.1 v35.46,37.2 | v21.59,40.64 21.59,42.33 U$1.27
  Bottom 0.2: v35.46,37.2 35.46,40.14 33.39,42.21 24.43,42.21 22.86,40.64 v21.59,40.64
N$12  (via drill 0.35)
  Top 0.152: v12.7,26.67 14.33,28.3 16.7,28.3 17.38,28.98 R_I2.6
  Bottom 0.152: U$7.2_A v12.7,26.67
N$13  (via drill 0.35)
  Top 0.152: R_I3.1 22.3,24.73 21.34,23.77 v21.34,22.61 21.34,21.38 21.73,20.99 22.43,20.99 NAND2.12 22.36,20.83 22.36,20.4 NAND2.13
  Bottom 0.152: v21.34,22.61 21.59,22.35 U$6.1_C
N$14  (via drill 0.35)
  Top 0.152: R_I2.7 18.18,28.83 16.02,26.67 v15.37,26.67
  Bottom 0.152: v15.37,26.67 15.24,26.8 U$7.3_A
N$15  (via drill 0.35)
  Top 0.152: v17.78,26.67 19.05,27.95 R_I2.8
  Bottom 0.152: U$7.4_A v17.78,26.67
N$16  (via drill 0.35)
  Top 0.152: R_I2.5 15.9,29.63 15.64,29.36 11.43,29.36 v11.23,29.16
  Bottom 0.152: v11.23,29.16 10.75,29.16 10.16,28.57 U$7.1_A
N$17  (via drill 0.35)
  Top 0.152: R_I4.3 13.84,24.71 13.84,23.24 14.61,22.48 v15.24,22.48 15.65,22.89 NAND1.6 NAND1.5
  Bottom 0.152: v15.24,22.48 U$7.3_C
N$18  (via drill 0.35)
  Top 0.152: R_I3.3 26.67,24.71 v26.67,22.48 27.3,22.48 27.54,22.24 NAND2.5 NAND2.6
  Bottom 0.152: v26.67,22.48 U$6.3_C
N$19  (via drill 0.35)
  Top 0.152: R_I4.4 16.91,24.73 18.11,23.53 v18.11,22.61 18.11,20.77 17.62,20.29 NAND1.2 NAND1.1
  Bottom 0.152: v18.11,22.61 18.11,21.92 U$7.4_C
N$20  (via drill 0.35)
  Top 0.152: NAND1.3 16.28,20.95 15.96,20.63 15.96,19.5 v17.91,17.55 | v11.46,8.23 11.77,7.92 v14.04,7.92
  Bottom 0.152: U$11.3 13.14,7.36 13.7,7.92 v14.04,7.92 14.25,8.13 15.37,8.13 | R_I6.2 11.44,8.25 v11.46,8.23 | R6.2 15.37,8.13 | 15.37,8.13 15.37,9.51 17.91,12.05 v17.91,17.55
N$21  (via drill 0.35)
  Top 0.152: R_I4.2 13.33,23.18 v12.7,22.55 12.36,22.89 NAND1.9 NAND1.8
  Bottom 0.152: v12.7,22.55 U$7.2_C
N$22  (via drill 0.35)
  Top 0.152: v10.72,11.81 10.61,11.81 9.27,10.48 9.27,9.85 8.82,9.4 LED8.A
  Bottom 0.152: R_I6.6 10.94,11.59 v10.72,11.81
N$23  (via drill 0.35)
  Top 0.152: v12,11.47 12.14,11.33 12.14,10.57 13.31,9.4 LED7.A
  Bottom 0.152: R_I6.7 11.44,11.04 11.87,11.47 v12,11.47
N$24
  Bottom 0.61: U$9.6 21.91,6.32 ES3.P$2
N$25
  Bottom 0.61: U$8.4 23.88,16.48 ES1.P$2
N$26
  Bottom 0.61: U$8.6 28.07,16.54 ES2.P$2
N$27
  Bottom 0.61: U$9.4 ES4.P$2
N$28  (via drill 0.35)
  Top 0.152: LED4.A 21.59,9.4 22.23,10.03 22.23,11.18 22.61,11.56 v23.5,11.56
  Bottom 0.152: v23.5,11.56 23.52,11.54 R_I7.6
N$29
  Bottom 0.61: U$10.6 13.34,16.48 ES6.P$2
N$30
  Bottom 0.61: U$11.6 ES7.P$2
N$31
  Top 0.152: U$1.12 19.92,31.75 19.5,31.33 R_I2.1
N$32
  Bottom 0.61: ES8.P$2 15.3,6.32 U$11.4
N$33
  Top 0.152: R_I2.2 18.18,31.95 19.12,32.89 U$1.11
N$34
  Top 0.152: R_I2.3 17.38,32.19 18.32,33.12 U$1.10
N$35
  Top 0.152: U$1.9 17.25,33.8 16.5,33.05 R_I2.4
N$36
  Top 0.152: U$1.13 20.72,32.46 21.85,31.33 R_I1.4
N$37
  Top 0.152: R_I1.3 23.73,32.1 23.57,32.26 22.23,32.26 21.52,32.96 U$1.14
N$38  (via drill 0.35)
  Top 0.152: R_I1.5 22.86,27.93 v21.59,26.67
  Bottom 0.152: v21.59,26.67 U$6.1_A
N$39
  Top 0.152: U$1.15 22.35,33.77 22.35,33.09 22.61,32.84 23.8,32.84 24.53,32.11 R_I1.2
N$40  (via drill 0.35)
  Top 0.2: U$1.28 20.72,43.08 v21.09,43.45 | v36.45,37.17 36.43,37.15 R_I5.7
  Bottom 0.2: v21.09,43.45 21.22,43.58 33.89,43.58 36.45,41.02 v36.45,37.17
N$41  (via drill 0.35)
  Top 0.152: R_I1.1 v25.41,32.51 v25.4,32.51 | v25.91,36.2 25.81,36.1 U$1.18
  Bottom 0.152: v25.4,32.51 25.4,35.69 v25.91,36.2
N$42  (via drill 0.35)
  Top 0.2: R_I5.4 v38.1,33.31
  Bottom 0.2: v38.1,33.31 38.1,31.59 U$23.B_A
  other vias: 39.53,30.17
N$43  (via drill 0.35)
  Top 0.2: R_I5.1 v35.55,33.31
  Bottom 0.2: U$23.R_A 36.83,30.48 35.55,31.75 v35.55,33.31
  other vias: 36.83,30.17
N$44  (via drill 0.35)
  Top 0.2: R_I5.2 v36.43,33.31
  Bottom 0.2: U$23.G_A 36.43,31.92 v36.43,33.31
  other vias: 38.18,30.17
N$45  (via drill 0.35)
  Top 0.152: NAND1.4 15.91,21.59 15.34,21.02 15.34,19.05 v17.02,17.37 | v17.02,12.72 16.92,12.62 12.32,12.62 10.64,10.94 10.64,8.36 v10.44,8.16
  Bottom 0.152: v17.02,17.37 v17.02,12.72 | R_I6.3 10.94,8.47 10.64,8.16 v10.44,8.16 | R7.2 10.4,8.13 v10.44,8.16 | v10.44,8.16 11.24,7.36 U$11.1
N$46
  Bottom 0.61: U$10.4 9.15,16.41 ES5.P$2
N$47  (via drill 0.35)
  Top 0.152: R_I3.2 26.15,23.48 25.15,22.48 v24.13,22.48 24,22.61 24,23.11 23.58,23.54 NAND2.8 NAND2.9
  Bottom 0.152: v24.13,22.48 U$6.2_C
N$48  (via drill 0.35)
  Top 0.152: R_I3.4 28.34,24.73 29.54,23.53 v29.54,22.61 29.54,20.9 28.93,20.29 NAND2.2 NAND2.1
  Bottom 0.152: v29.54,22.61 29.34,22.41 29.34,21.72 U$6.4_C
N$49  (via drill 0.35)
  Top 0.152: R_I4.1 9.55,24.73 9.02,24.19 v9.02,22.61 9.02,21.84 8.63,21.46 8.63,20.81 8.89,20.56 10.06,20.56 10.45,20.94 NAND1.12 NAND1.13
  Bottom 0.152: U$7.1_C 10.09,21.66 9.96,21.66 v9.02,22.61
N$50  (via drill 0.35)
  Top 0.152: NAND1.10 11.06,22.23 11.94,22.23 13.27,20.89 13.27,15.3 v13.34,15.24 | v12.7,10.8 13.89,12 14.1,12 14.14,12.04 R9.2
  Bottom 0.152: v13.34,15.24 13.27,15.17 U$10.1 13.27,12.33 13.54,12.06 R9.2 | R_I6.8 12.48,10.59 v12.7,10.8
  other vias: 14.14,12.06
N$51  (via drill 0.35)
  Top 0.152: NAND2.3 27.62,20.94 27.38,20.7 27.38,19.21 27.95,18.64 30.25,18.64 v30.48,18.41 | v25.91,7.87 25.36,8.42 v24.47,8.42 | v30.48,14.22 v30.48,11.3
  Bottom 0.152: v25.91,7.87 25.97,7.81 U$9.3 26.17,6.76 27.54,8.13 R13.2 28.91,8.93 28.91,9.63 30.48,11.2 v30.48,11.3 | v24.47,8.42 24.02,8.88 R_I7.2 | v30.48,18.41 v30.48,14.22
N$52  (via drill 0.35)
  Top 0.152: NAND2.4 27.25,21.59 26.47,20.81 26.47,18.81 27.39,17.89 v29.26,17.89 | v29.46,13.59 v29.46,11.43
  Bottom 0.152: v29.46,11.43 29.46,11.3 28.57,10.41 27.56,10.41 24.89,7.75 24.36,7.75 24.07,7.46 24.07,7.4 | v29.26,17.89 29.26,13.79 v29.46,13.59 | U$9.1 24.07,7.4 | 24.07,7.4 23.34,8.13 | 23.34,8.13 23.4,8.13 23.52,8.24 R_I7.3 | 23.34,8.13 R12.2
N$53  (via drill 0.35)
  Top 0.152: v26.67,15.24 26.67,15.44 25.27,16.84 25.27,20.25 23.28,22.24 NAND2.10
  Bottom 0.152: v26.67,15.24 26.67,14.77 U$8.1 25.84,12.16 26,12 | R10.2 26.64,12 26,12 | R_I7.8 24.57,10.95 25.61,12 26,12
N$54  (via drill 0.35)
  Top 0.152: v23.5,20.55 23.5,21.16 23.06,21.59 NAND2.11 | v24.11,15.24 22.86,16.49 v22.86,17.88
  Bottom 0.152: v23.5,20.55 22.86,19.91 v22.86,17.88 | R_I7.5 22.86,10.69 22.86,12.4 | 22.86,12.4 22.86,12.86 U$8.3 24.11,14.11 v24.11,15.24 | R11.2 22.52,12.06 22.86,12.4
N$55  (via drill 0.35)
  Bottom 0.152: LED9.A 9.36,9.53 10.35,9.53 R_I6.4
  other vias: 8.09,10.79
N$56  (via drill 0.35)
  Top 0.152: v14.12,10.79 LED6.A | v13.43,8.52 12.31,8.52 v12.12,8.72
  Bottom 0.152: v14.12,10.79 13.89,10.79 13.71,10.61 13.71,8.8 v13.43,8.52 | v12.12,8.72 11.99,8.84 R_I6.1
N$57  (via drill 0.35)
  Top 0.152: v9.19,21.21 9.39,21.21 9.77,21.59 NAND1.11 | v11.15,18.34 11.18,18.32 v11.18,15.11
  Bottom 0.152: v9.19,21.21 9.19,20.3 v11.15,18.34 | R_I6.5 10.16,10.82 10.16,11.73 | 10.16,11.73 10.16,12.6 U$10.3 11.18,13.81 v11.18,15.11 | R8.2 9.82,12.06 10.16,11.73
N$58  (via drill 0.35)
  Top 0.152: v24.38,11.56 25.27,11.56 25.55,11.28 25.55,10.55 LED3.A
  Bottom 0.152: R_I7.7 24.02,11.19 v24.38,11.56
N$59  (via drill 0.35)
  Bottom 0.152: LED5.A 21.66,10.79 R_I7.4
  other vias: 20.79,10.79
N$60  (via drill 0.35)
  Bottom 0.152: R_I7.1 25.87,10.79 LED2.A
  other vias: 26.71,10.79
N$62  (via drill 0.35)
  other vias: 17.6,35.4
N$63  (via drill 0.35)
  other vias: 18.9,35.4
N$64  (via drill 0.35)
  other vias: 20.1,35.4
N$65  (via drill 0.35)
  other vias: 23,36.9
N$66  (via drill 0.35)
  other vias: 21.2,36.7
N$67  (via drill 0.35)
  other vias: 21.4,38.6
N$68  (via drill 0.35)
  other vias: 20.4,38.6
N$70  (via drill 0.35)
  other vias: 23.3,40.1
N$73  (via drill 0.35)
  other vias: 23.1,38.9
NRST  (via drill 0.35)
  Top 0.152: U$1.4 v14.86,38.5 14.86,37.72 11.43,34.29 U$4.P$1
  Top 0.305: v14.99,42.04 14.99,45.07 17.71,47.79 34.8,47.79 38.98,43.62 U$13.P$9
  Bottom 0.152: C9.1 U$4.P$1 | v14.99,42.04 14.99,38.63 v14.86,38.5
  other vias: 11.43,31.75
RX  (via drill 0.35)
  Top 0.305: v19.18,46.17 19.12,46.17 U$1.30 | U$13.P$1 43.6,47.79 v43.58,47.79
  Bottom 0.305: v43.58,47.79 20.8,47.79 v19.18,46.17
TX  (via drill 0.35)
  Top 0.305: U$1.29 19.92,44.73 v20.3,45.11 | U$13.P$8 39.52,44.88 v38.1,46.3
  Bottom 0.305: v38.1,46.3 21.49,46.3 v20.3,45.11
V3.3  (via drill 0.35)
  Top 0.152: R1.2 U$3.3 | C8.1 16.04,37.72 U$1.5
  Top 0.305: v14.22,41.4 14.73,40.9 U$1.1 17,40.9 | C1.2 17.62,40.9 17,40.9 | C10.1 26.76,35.3 U$1.17 22.95,35.3 C2.1 21.97,36.28 21.97,37.01 21.26,37.72 C8.1 17.44,40.46 17,40.9 | C10.1 32.35,34.89 33.31,35.85 U$5.P$5 | C10.1 31.42,34.89 33.92,32.38 38.2,32.38 | 38.2,32.38 46.2,32.38 48.2,34.38 48.2,37.6 47.3,38.5 46.5,38.5 U$13.P$6 | R_I5.5 38.51,36.16 39,35.66 39,33.19 38.2,32.38
  Bottom 0.305: v14.22,41.4 14.14,41.49 C7.1
  Bottom 1.27: C7.1 8.93,41.49 U$3.3
  other vias: 8.89,41.45 17.78,41.06 22.86,35.39 17.44,37.72
  pour Bottom (no thermals): 10.16,40.64 15.24,40.64 15.24,43.18 10.16,43.18
  pour Top (no thermals): 14.1,51.53 14.1,30.48 51.53,30.48 51.53,51.53
V12
  Bottom 0.152: BOX10P-L2.P$1 BOX10P-L2.P$2
VCC  (via drill 0.35)
  Top 0.152: C3.1 5.05,37.28 U$2.6
  Top 0.305: U$2.6 U$2.1 | v18.29,39.75 21.21,39.75 v22.86,38.1
  Top 1.27: BOX10P-L2.P$10 BOX10P-L2.P$9 5.08,36.41 C3.1
  Bottom 0.152: U$5.P$3 28.03,38.1 29.21,38.1 C14.1
  Bottom 0.305: U$5.P$3 27.78,38.1 v22.86,38.1 | v18.29,39.75 17.61,39.75 15.62,41.74 15.62,42.3 14.97,42.95 U$3.2
  Bottom 1.27: U$3.2 U$3.2@2
  Bottom 2.54: BOX10P-L2.P$10 2.54,42.04 3.45,42.95 U$3.2@2
  other vias: 27.91,38.23
  pour Bottom (no thermals): -0.73,29.97 6.35,29.97 6.35,38.1 8.89,38.1 8.89,51.53 -0.73,51.53
  pour Top (no thermals): 1.27,29.97 6.1,29.97 6.1,38.61 1.27,38.61
VDD  (via drill 0.35)
  Top 0.152: v12.72,19.66 12.69,19.64 NAND1.14 | v23.66,19.18 23.2,19.64 NAND2.14
  Top 0.305: NAND1.14 8.3,19.64 7.62,20.32 7.62,24.8 8.65,25.83 R_I4.8 R_I4.7 R_I4.6 R_I4.5 21.6,25.83 | NAND2.14 21,19.64 20.12,20.52 20.12,24.35 21.6,25.83 | LED1.A 44.45,25.4 27.63,25.4 R_I3.5 R_I3.6 R_I3.7 R_I3.8 21.6,25.83
  Top 0.61: U$21.+ 36.74,6.99 v36.74,7.53
  Top 1.016: ES6.P$1 15.49,13.94 21.72,13.94 ES1.P$1
  Top 1.27: ES5.P$1 9.08,13.84 12.57,13.84 12.61,13.88 ES6.P$1 | ES1.P$1 ES2.P$1 28.18,13.88 29.64,15.34 30.94,15.34 32,14.28 32,7.8 32.9,6.9 | ES7.P$1 ES8.P$1 ES3.P$1 ES4.P$1 29.62,3.72 32.8,6.9 32.9,6.9 | U$12.P$2 45.05,9.49 42.46,6.9 U$21.+ 32.9,6.9
  Bottom 0.152: C13.1 v12.72,19.66 | C12.1 v23.66,19.18
  Bottom 0.406: LED1.A 47.26,22.59 | 47.26,12.99 47.25,12.99
  Bottom 0.61: C11.1 36.83,7.62 v36.74,7.53
  Bottom 1.27: 47.26,22.59 47.26,12.99 | 47.25,12.99 U$12.P$2
  pour Top (no thermals): 34.29,12.7 51.53,12.7 51.53,-0.73 -0.73,-0.73 -0.73,17.78 34.29,17.78

### Text on the board
tPlace: MtLord-REF-EaSiri_Dora ver.3.1 | KRP | 0.hayate
bPlace: 5 | 6 | 1 | 2 | 7 | 8 | 3 | 4